# EasyEDA Pro project CH32V203_Wireless_Charge_V1.0.eprj, board PCB4
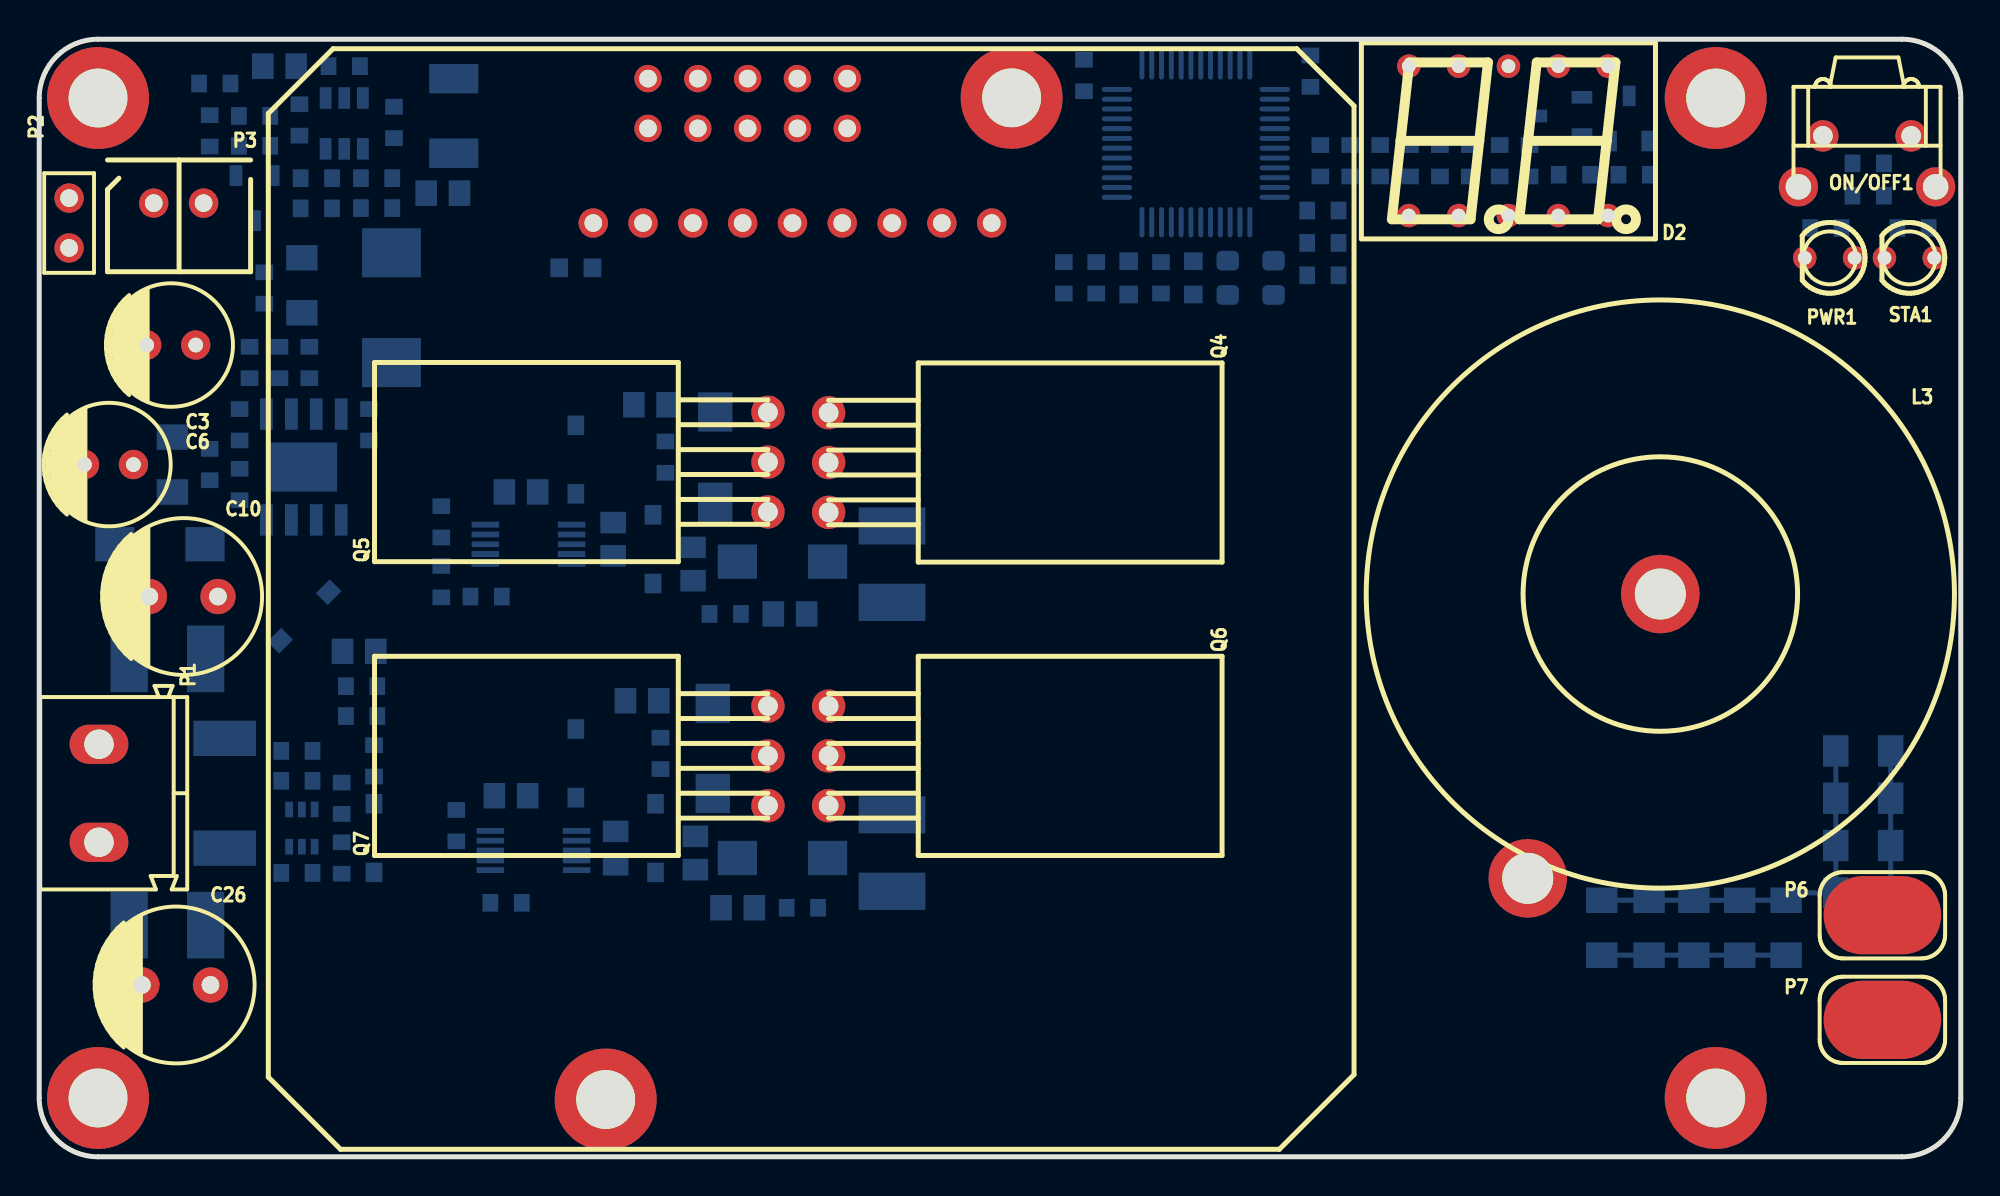
[diagram p4: board, top side]
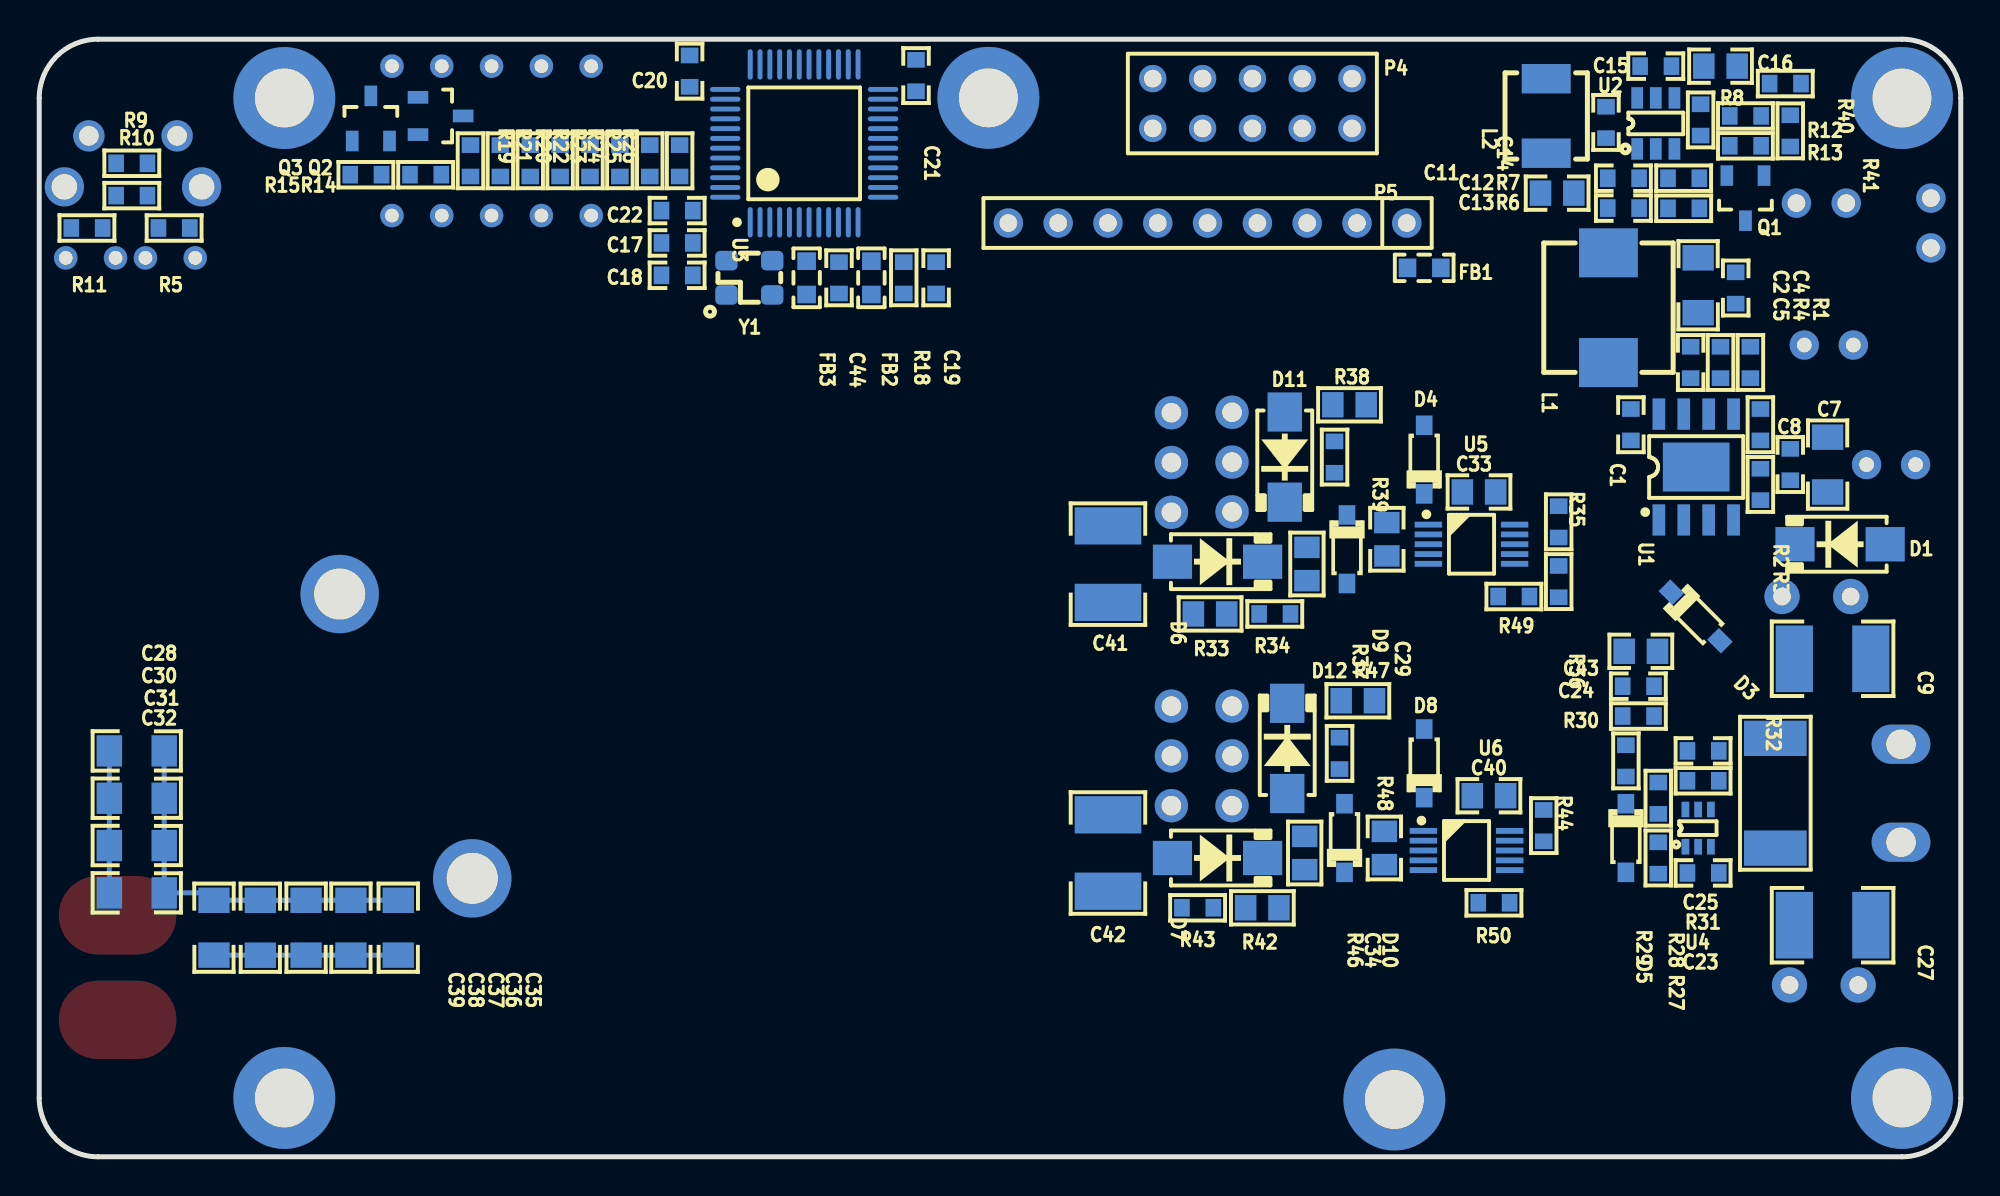
[diagram p5: board, bottom side, seen from below]

Outline 98 x 57 mm; copper layers: Top Layer, Bottom Layer. Coordinates in mm from the lower left corner of the outline.
Outline path: 0,54 0,3 arc(0.88,0.88) 3,0 95,0 arc(97.12,0.88) 98,3 98,54 arc(97.12,56.12) 95,57 3,57 arc(0.88,56.12) 0,54
Stack: Top Layer 0.035mm / Dielectric1 1.51mm FR4 er 4.5 / Bottom Layer 0.035mm

## Design rules (mm)
template: JLCPCB Capability(Two Layers Board)
spacing copperThickness1oz (default): track to track 0.102, other pairs 0.152 to 0.3
spacing copperThickness2oz: track to track 0.203, other pairs 0.152 to 0.3
track width copperThickness1oz (default): min 0.127, default 0.254, max 2.54
track width copperThickness2oz: min 0.203, default 0.254, max 2.54
differential pair differentialPair (default): width min 0.127, default 0.254, max 2.54; gap min 0.152, default 0.152
via viaSize (default): diameter min 0.5, default 0.61, max 10; hole min 0.3, default 0.305, max 6.3

## Placement (name value [footprint] x y rotation side)
C1  100nF  [CAPC1608[0603]S-N]  16.82 37.34 90 bottom
C2  47uF  [CAPC3216[1206]S]  13.4 44.45 270 bottom
C3  220uF  [Cap-S-D 2.5-6.3X8]  6.73 41.4 180 top
C4  100nF  [CAPC1608[0603]S-N]  11.48 44.31 270 bottom
C5  4.7nF  [CAPC1608[0603]S-N]  13.78 40.51 90 bottom
C6  100uF  [Cap-S-D 2.5-6.3X8]  3.56 35.31 180 top
C7  4.7uF  [CAPC3216[1206]S]  6.79 35.31 270 bottom
C8  100nF  [CAPC1608[0603]S-N]  8.7 35.31 270 bottom
C9  47uF  [CAPC4532[1812]S]  6.54 25.4 180 bottom
C10  470uF  [Cap-S-D 3.5-8x14]  7.37 28.58 180 top
C11  22uF  [CAPC2012[0805]S-N]  20.59 49.15 0 bottom
C12  100nF  [CAPC1608[0603]S-N]  17.21 49.91 180 bottom
C13  220pF  [CAPC1608[0603]S-N]  17.21 48.39 180 bottom
C14  100nF  [CAPC1608[0603]S-N]  18.09 52.76 90 bottom
C15  100nF  [CAPC1608[0603]S-N]  15.55 55.63 180 bottom
C16  22uF  [CAPC2012[0805]S-N]  12.25 55.63 0 bottom
C17  18pF  [CAPC1608[0603]S-N]  65.47 46.61 180 bottom
C18  18pF  [CAPC1608[0603]S-N]  65.47 44.96 180 bottom
C19  100nF  [CAPC1608[0603]S-N]  52.26 44.83 90 bottom
C20  100nF  [CAPC1608[0603]S-N]  64.83 55.37 90 bottom
C21  100nF  [CAPC1608[0603]S-N]  53.28 55.15 90 bottom
C22  100nF  [CAPC1608[0603]S-N]  65.47 48.26 180 bottom
C23  100nF  [CAPC1608[0603]S-N]  13.14 14.48 180 bottom
C24  100nF  [CAPC1608[0603]S-N]  16.44 24 180 bottom
C25  1uF  [CAPC1608[0603]S-N]  13.14 20.7 180 bottom
C26  470uF  [Cap-S-D 3.5-8x14]  6.98 8.76 180 top
C27  47uF  [CAPC4532[1812]S]  6.54 11.81 180 bottom
C28  10nF  [CAPC3216[1206]S]  93.02 20.7 0 bottom
C29  10uF  [CAPC2012[0805]S-N]  29.27 31.5 270 bottom
C30  10nF  [CAPC3216[1206]S]  93.02 18.29 0 bottom
C31  10nF  [CAPC3216[1206]S]  93.02 15.88 0 bottom
C32  10nF  [CAPC3216[1206]S]  93.02 13.46 0 bottom
C33  22uF  [CAPC2012[0805]S-N]  24.57 33.91 180 bottom
C34  10uF  [CAPC2012[0805]S-N]  29.4 15.75 270 bottom
C35  1nF  [CAPC3216[1206]S]  79.69 11.68 90 bottom
C36  1nF  [CAPC3216[1206]S]  82.1 11.68 90 bottom
C37  100nF  [CAPC3216[1206]S]  84.39 11.68 90 bottom
C38  100nF  [CAPC3216[1206]S]  86.72 11.68 90 bottom
C39  100nF  [CAPC3216[1206]S]  89.09 11.68 90 bottom
C40  22uF  [CAPC2012[0805]S-N]  24.06 18.42 0 bottom
C41  47uF  [CAPC4532[1812]S]  43.49 30.23 270 bottom
C42  47uF  [CAPC4532[1812]S]  43.49 15.49 90 bottom
C43  10uF  [CAPC2012[0805]S-N]  16.32 25.78 180 bottom
C44  100nF  [CAPC1608[0603]S-N]  57.21 44.83 90 bottom
D1  SS54  [SMA-L[DO-214AC]]  6.16 31.24 0 bottom
D2  2821BS  [2821AS/BS]  74.93 51.82 0 top
D3  SMF3.3A  [SOD-123-L]  13.52 27.56 45 bottom
D4  1N4148  [SOD-123-L]  27.37 35.56 270 bottom
D5  1N4148  [SOD-123-L]  17.08 16.26 90 bottom
D6  SS54  [SMA-L[DO-214AC]]  37.91 30.35 180 bottom
D7  SS54  [SMA-L[DO-214AC]]  37.91 15.24 180 bottom
D8  1N4148  [SOD-123-L]  27.37 20.07 270 bottom
D9  SMF12A  [SOD-123-L]  31.3 30.99 90 bottom
D10  SMF12A  [SOD-123-L]  31.43 16.26 270 bottom
D11  SS54  [SMA-L[DO-214AC]]  34.48 35.69 270 bottom
D12  SS54  [SMA-L[DO-214AC]]  34.35 20.83 90 bottom
FB1  0R  [INDC1608[0603]S]  27.37 45.34 0 bottom
FB2  0R  [INDC1608[0603]S]  55.56 44.83 90 bottom
FB3  0R  [INDC1608[0603]S]  58.86 44.83 270 bottom
L1  4.7uH  [0630 TPC 7*7*3]  17.97 43.31 90 bottom
L2  3.3uH  [0402 TPC 4*4*2]  21.14 53.09 270 bottom
L3  3.722uH  [T94/106-LAY]  82.68 28.7 245 top
M1  MountHole  [M3-MountHole-Plated]  3 54 0 top
M2  MountHole  [M3-MountHole-Plated]  85.5 54 0 top
M3  MountHole  [M3-MountHole-Plated]  3 3 0 top
M4  MountHole  [M3-MountHole-Plated]  85.5 3 0 top
M5  MountHole  [M3-MountHole-Plated]  49.59 54.01 180 bottom
M6  MountHole  [M3-MountHole-Plated]  28.89 2.92 180 bottom
ON/OFF1  Button  [KEY-2-DIP-6*6-S]  93.22 52.07 0 top
P1  KF/WJ/DG 30x connecter  [KF/WJ/DG 301-2p-5.0mm]  3.05 18.54 270 top
P2  Header-D-M 1x2P  [HDR1X2-M]  1.52 48.9 270 top
P3  XH2.54-2P  [XH2.54-2P-DV]  5.84 48.64 0 top
P4  SWD  [HDR2X5-M]  31.05 54.99 0 bottom
P5  Header-D-M 1x9P  [HDR1X9-M]  28.25 47.63 0 bottom
P6  WirePad  [WirePad-4x6]  94 12.32 0 top
P7  WirePad  [WirePad-4x6]  94 6.99 0 top
PWR1  LED 3R  [LED-R3-H5-SINGLE-R]  91.31 45.85 180 top
Q1  AO3400  [SOT-23]  10.98 48.9 270 bottom
Q2  S8550  [SOT-23]  77.53 53.09 180 bottom
Q3  S8550  [SOT-23]  81.09 52.96 90 bottom
Q4  HYG180N10LS1P  [TO-220-LAY]  40.26 37.95 270 top
Q5  HYG180N10LS1P  [TO-220-LAY]  37.17 32.89 90 top
Q6  HYG180N10LS1P  [TO-220-LAY]  40.26 22.99 270 top
Q7  HYG180N10LS1P  [TO-220-LAY]  37.17 17.91 90 top
R1  140K  [RESC1608[0603]S-N]  10.73 40.51 270 bottom
R2  10K  [RESC1608[0603]S-N]  10.22 37.34 270 bottom
R3  200K  [RESC1608[0603]S-N]  10.22 34.29 270 bottom
R4  20K  [RESC1608[0603]S-N]  12.25 40.51 270 bottom
R5  2.7K  [RESC1608[0603]S-N]  91.12 47.37 180 bottom
R6  30K  [RESC1608[0603]S-N]  14.13 48.38 180 bottom
R7  15K  [RESC1608[0603]S-N]  14.13 49.91 0 bottom
R8  10K  [RESC1608[0603]S-N]  13.27 52.88 90 bottom
R9  10K  [RESC1608[0603]S-N]  93.28 50.67 0 bottom
R10  100R  [RESC1608[0603]S-N]  93.28 49.02 0 bottom
R11  2.7K  [RESC1608[0603]S-N]  95.56 47.37 0 bottom
R12  100R  [RESC1608[0603]S-N]  10.98 53.09 180 bottom
R13  10K  [RESC1608[0603]S-N]  10.98 51.56 0 bottom
R14  100R  [RESC1608[0603]S-N]  78.29 50.09 180 bottom
R15  100R  [RESC1608[0603]S-N]  81.34 50.09 180 bottom
R18  10K  [RESC1608[0603]S-N]  53.91 44.83 90 bottom
R19  1K  [RESC1608[0603]S-N]  76.01 50.8 90 bottom
R20  1K  [RESC1608[0603]S-N]  72.96 50.8 90 bottom
R21  1K  [RESC1608[0603]S-N]  74.48 50.8 270 bottom
R22  1K  [RESC1608[0603]S-N]  71.43 50.8 270 bottom
R23  1K  [RESC1608[0603]S-N]  69.91 50.8 270 bottom
R24  1K  [RESC1608[0603]S-N]  68.39 50.8 90 bottom
R25  1K  [RESC1608[0603]S-N]  66.86 50.8 270 bottom
R26  1K  [RESC1608[0603]S-N]  65.34 50.8 270 bottom
R27  0R  [RESC1608[0603]S-N]  15.43 15.24 270 bottom
R28  0R(NC)  [RESC1608[0603]S-N]  15.43 18.29 90 bottom
R29  5.1K  [RESC1608[0603]S-N]  17.08 20.19 90 bottom
R30  510R  [RESC1608[0603]S-N]  16.44 22.48 180 bottom
R31  1K  [RESC1608[0603]S-N]  13.14 19.18 0 bottom
R32  2mR  [RESC6332[2512]S]  9.46 18.54 270 bottom
R33  10R  [RESC2012[0805]S-N]  38.29 27.69 180 bottom
R34  10K  [RESC1608[0603]S-N]  34.99 27.69 0 bottom
R35  10K  [RESC1608[0603]S-N]  20.51 32.39 90 bottom
R36  10K  [RESC1608[0603]S-N]  20.51 29.34 270 bottom
R37  2.2R  [RESC2012[0805]S-N]  33.35 30.23 90 bottom
R38  10R  [RESC2012[0805]S-N]  31.18 38.35 0 bottom
R39  10K  [RESC1608[0603]S-N]  31.94 35.69 90 bottom
R40  100R  [RESC1608[0603]S-N]  8.95 54.74 180 bottom
R41  10K  [RESC1608[0603]S-N]  8.7 52.32 90 bottom
R42  10R  [RESC2012[0805]S-N]  35.62 12.7 180 bottom
R43  10K  [RESC1608[0603]S-N]  38.92 12.7 180 bottom
R44  10K  [RESC1608[0603]S-N]  21.27 16.89 270 bottom
R46  2.2R  [RESC2012[0805]S-N]  33.46 15.49 270 bottom
R47  10R  [RESC2012[0805]S-N]  30.75 23.26 180 bottom
R48  10K  [RESC1608[0603]S-N]  31.68 20.57 90 bottom
R49  10K  [RESC1608[0603]S-N]  22.79 28.58 180 bottom
R50  10K  [RESC1608[0603]S-N]  23.81 12.95 180 bottom
STA1  LED  [LED-R3-H5-SINGLE-B]  96.65 45.85 180 top
U1  SP1N28STER  [SOP-8E]  13.49 35.18 90 bottom
U2  RY8121  [SOT-23-6]  15.55 52.71 90 bottom
U3  CH32V203CxT6  [LQFP48_L]  58.99 51.69 90 bottom
U4  TP181A1  [SOT-363]  13.4 16.76 90 bottom
U5  DGD0506A  [MSOP-10]  24.95 31.24 180 bottom
U6  DGD0506A  [MSOP-10]  25.21 15.62 180 bottom
Y1  8MHz  [X3225-4]  61.78 44.83 180 bottom

## Footprints (pads in the part's own frame, mm; a bottom-side part is the same pattern mirrored in y, then rotated)
0402 TPC 4*4*2
  rect 1.5x2.5 smd: 1(-1.9,0) 2(1.9,0)
0630 TPC 7*7*3
  rect 2.5x3 smd: 1(-2.8,0) 2(2.8,0)
2821AS/BS
  round 1.2 hole 0.7: 1(-5.08,-3.81) 2(-2.54,-3.81) 3(0,-3.81) 4(2.54,-3.81) 5(5.08,-3.81) 6(5.08,3.81) 7(2.54,3.81) 8(0,3.81) 9(-2.54,3.81) 10(-5.08,3.81)
Cap-S-D 2.5-6.3X8
  rrect 1.5x1.5 hole 0.75: 1(-1.25,0)
  round 1.5 hole 0.75: 2(1.25,0)
Cap-S-D 3.5-8x14
  rrect 1.8x1.8 hole 0.9: 1(-1.75,0)
  round 1.8 hole 0.9: 2(1.75,0)
CAPC1608[0603]S-N
  rect 0.8x0.9 smd: 1(-0.8,0) 2(0.8,0)
CAPC2012[0805]S-N
  rect 1.1x1.3 smd: 1(-0.85,0) 2(0.85,0)
CAPC3216[1206]S
  rect 1.3x1.6 smd: 1(-1.4,0) 2(1.4,0)
CAPC4532[1812]S
  rect 1.9x3.4 smd: 1(-1.95,0) 2(1.95,0)
HDR1X2-M
  round 1.5 hole 0.9: 1(0,0) 2(2.54,0)
HDR1X9-M
  round 1.5 hole 0.9: 1(0,0) 2(2.54,0) 3(5.08,0) 4(7.62,0) 5(10.16,0) 6(12.7,0) 7(15.24,0) 8(17.78,0) 9(20.32,0)
HDR2X5-M
  round 1.397 hole 0.9: 1(0,0) 2(0,2.54) 3(2.54,0) 4(2.54,2.54) 5(5.08,0) 6(5.08,2.54) 7(7.62,0) 8(7.62,2.54) 9(10.16,0) 10(10.16,2.54)
INDC1608[0603]S
  rect 0.9x0.95 smd: 1(-0.85,0) 2(0.85,0)
KEY-2-DIP-6*6-S
  round 2 hole 1.3: 0(-3.5,-2.6) 0(3.5,-2.6)
  round 1.6 hole 1: 1(-2.25,0) 2(2.25,0)
KF/WJ/DG 301-2p-5.0mm
  oval 2x3 hole 1.5: 1(2.5,0) 2(-2.5,0)
LED-R3-H5-SINGLE-B
  round 1.2 hole 0.7: 1(0,0) 2(2.54,0)
LED-R3-H5-SINGLE-R
  round 1.2 hole 0.7: 1(-1.27,0) 2(1.27,0)
LQFP48_L
  oval 1.55x0.254 smd: 1(-4.025,2.75) 2(-4.025,2.25) 3(-4.025,1.75) 4(-4.025,1.25) 5(-4.025,0.75) 6(-4.025,0.25) 7(-4.025,-0.25) 8(-4.025,-0.75) 9(-4.025,-1.25) 10(-4.025,-1.75) 11(-4.025,-2.25) 12(-4.025,-2.75) 25(4.025,-2.75) 26(4.025,-2.25) 27(4.025,-1.75) 28(4.025,-1.25) 29(4.025,-0.75) 30(4.025,-0.25) 31(4.025,0.25) 32(4.025,0.75) 33(4.025,1.25) 34(4.025,1.75) 35(4.025,2.25) 36(4.025,2.75)
  oval 0.254x1.55 smd: 13(-2.75,-4.025) 14(-2.25,-4.025) 15(-1.75,-4.025) 16(-1.25,-4.025) 17(-0.75,-4.025) 18(-0.25,-4.025) 19(0.25,-4.025) 20(0.75,-4.025) 21(1.25,-4.025) 22(1.75,-4.025) 23(2.25,-4.025) 24(2.75,-4.025) 37(2.75,4.025) 38(2.25,4.025) 39(1.75,4.025) 40(1.25,4.025) 41(0.75,4.025) 42(0.25,4.025) 43(-0.25,4.025) 44(-0.75,4.025) 45(-1.25,4.025) 46(-1.75,4.025) 47(-2.25,4.025) 48(-2.75,4.025)
M3-MountHole-Plated
  round 5.2 hole 3: 1(0,0)
MSOP-10
  rect 1.4x0.3 smd: 1(-2.2,1) 2(-2.2,0.5) 3(-2.2,0) 4(-2.2,-0.5) 5(-2.2,-1) 6(2.2,-1) 7(2.2,-0.5) 8(2.2,0) 9(2.2,0.5) 10(2.2,1)
RESC1608[0603]S-N
  rect 0.8x0.9 smd: 1(-0.8,0) 2(0.8,0)
RESC2012[0805]S-N
  rect 1.1x1.3 smd: 1(-0.85,0) 2(0.85,0)
RESC6332[2512]S
  rect 1.8x3.2 smd: 1(-2.8,0) 2(2.8,0)
SMA-L[DO-214AC]
  rect 2x1.75 smd: A(-2.3,0) K(2.3,0)
SOD-123-L
  rect 1x0.85 smd: A(-1.75,0) K(1.75,0)
SOP-8E
  rect 2.5x3.4 smd: 0(0,0)
  rect 1.6x0.65 smd: 1(-2.7,1.905) 2(-2.7,0.635) 3(-2.7,-0.635) 4(-2.7,-1.905) 5(2.7,-1.905) 6(2.7,-0.635) 7(2.7,0.635) 8(2.7,1.905)
SOT-23
  rect 1.05x0.65 smd: 1(-1.15,0.95) 2(-1.15,-0.95) 3(1.15,0)
SOT-23-6
  rect 1.1x0.6 smd: 1(-1.3,0.95) 2(-1.3,0) 3(-1.3,-0.95) 4(1.3,-0.95) 5(1.3,0) 6(1.3,0.95)
SOT-363
  rect 0.8x0.4 smd: 1(-0.95,0.65) 2(-0.95,0) 3(-0.95,-0.65) 4(0.95,-0.65) 5(0.95,0) 6(0.95,0.65)
T94/106-LAY
  round 4 hole 2.6: 1(0,0) 2(16,0)
TO-220-LAY
  round 1.7 hole 1: 1(0,0) 2(2.54,0) 3(5.08,0)
WirePad-4x6
  rrect 6x4 smd: 1(0,0)
X3225-4
  rrect 1.143x1 smd: 1(-1.169,-0.874) 2(1.169,-0.874) 3(1.169,0.874) 4(-1.169,0.874)
XH2.54-2P-DV
  rrect 1.5x1.5 hole 0.9: 1(0,0)
  round 1.5 hole 0.9: 2(2.54,0)

## Nets
As in the schematic.

Pads without a net: M1 1; M2 1; M3 1; M4 1; M5 1; M6 1; ON/OFF1 0; P4 6 8; U3 2 3 4 21 22 25 26 27 28 32 33 46; U5 5; U6 5

## Routing (per net, layer and track width the routed paths; a pad name or vN(x,y) marks a point on that pad's centre or on a via; arc(x,y) is an arc through that point)
LCCB: length 9.4
  Bottom Layer w0.254: C35.1 C36.1 C37.1 84.39,10.28 C38.1 86.73,10.28 C39.1
$1N24970: length 7.2
  Bottom Layer w0.254: C28.2 C30.2 C31.2 C32.2
$1N25020: length 19.3
  Bottom Layer w0.254: C28.1 C30.1 C31.1 C32.1 89.47,13.46 C39.2 86.73,13.08 C38.2 84.39,13.08 C37.2 C36.2 C35.2

## Text on the board
Top Solder Mask Layer: 浙江工商大学
